# EAGLE schematic Programming_interface_PCB_Rev5 (EAGLE 9.6.2)

## Sheet 1 of 2
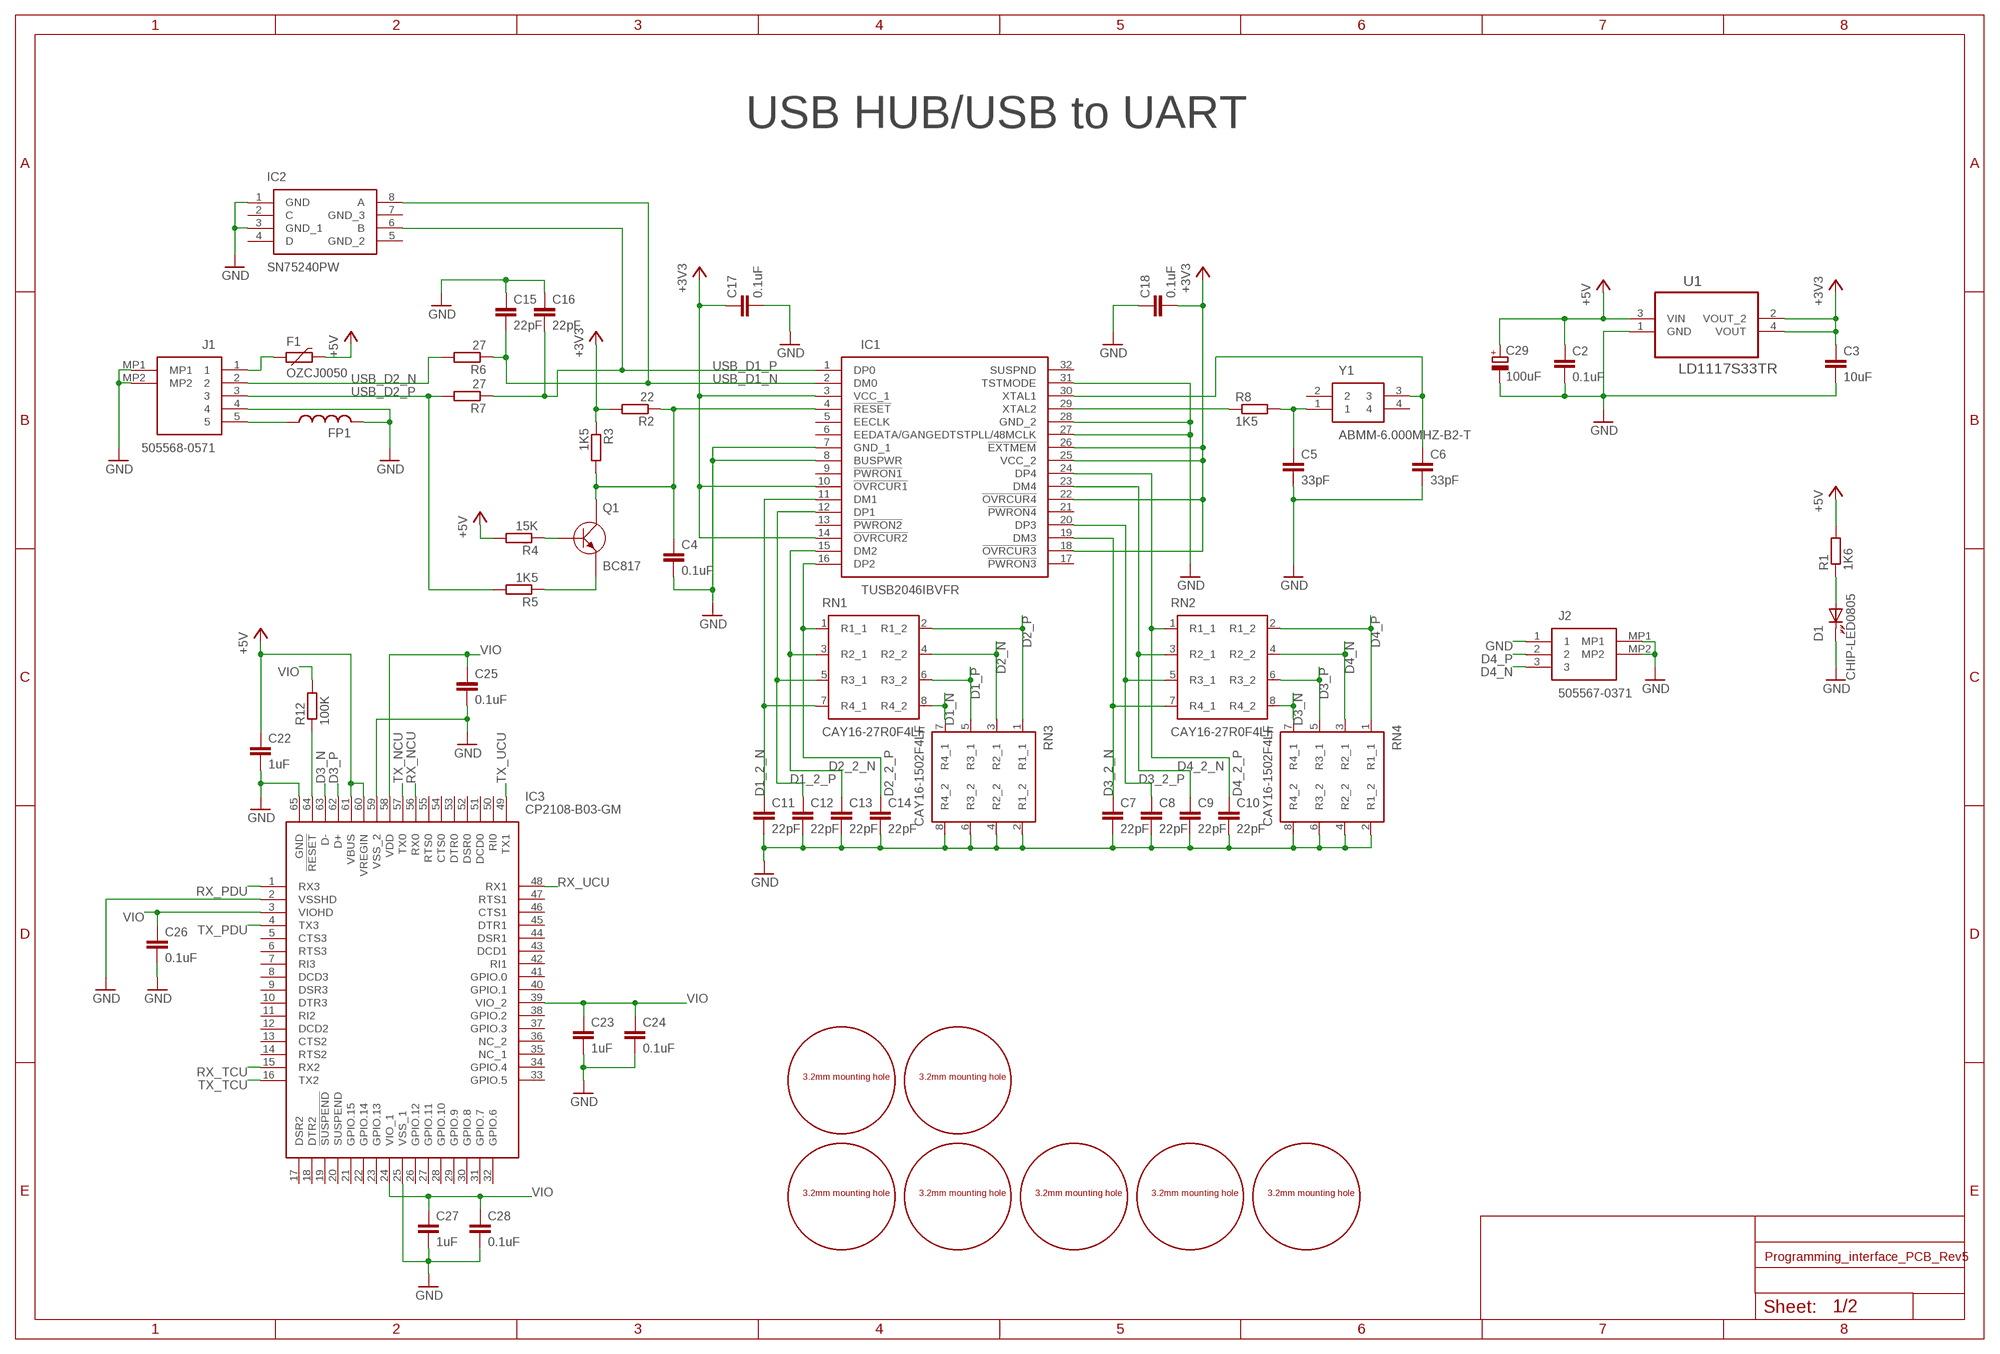
[diagram p0: schematic, sheet 1]

### Parts
C2  0.1uF  C0603  [C0603]
C3  10uF  C0603  [C0603]
C4  0.1uF  C0603  [C0603]
C5  33pF  C0603  [C0603]
C6  33pF  C0603  [C0603]
C7  22pF  C0603  [C0603]
C8  22pF  C0603  [C0603]
C9  22pF  C0603  [C0603]
C10  22pF  C0603  [C0603]
C11  22pF  C0603  [C0603]
C12  22pF  C0603  [C0603]
C13  22pF  C0603  [C0603]
C14  22pF  C0603  [C0603]
C15  22pF  C0603  [C0603]
C16  22pF  C0603  [C0603]
C17  0.1uF  C0603  [C0603]
C18  0.1uF  C0603  [C0603]
C22  1uF  C0603  [C0603]
C23  1uF  C0603  [C0603]
C24  0.1uF  C0603  [C0603]
C25  0.1uF  C0603  [C0603]
C26  0.1uF  C0603  [C0603]
C27  1uF  C0603  [C0603]
C28  0.1uF  C0603  [C0603]
C29  100uF  PANASONIC_C  [PANASONIC_C]
D1  CHIP-LED0805  [CHIP-LED0805]
F1  OZCJ0050  OZCJ  [OZCJ]
FP1  BLM18A  [R0603]
IC1  TUSB2046IBVFR  [QFP80P900X900X160-32N]
IC2  SN75240PW  [SOP65P640X120-8N]
IC3  CP2108-B03-GM  [QFN50P900X900X90-65N]
J1  505568-0571  [5055680571]
J2  505567-0371  [5055680371]
Q1  BC817  [SOT23]
R1  1K6  R0603  [R0603]
R2  22  R0805  [R0805]
R3  1K5  R0805  [R0805]
R4  15K  R0603  [R0603]
R5  1K5  R0603  [R0603]
R6  27  R0603  [R0603]
R7  27  R0603  [R0603]
R8  1K5  R0603  [R0603]
R12  100K  R0603  [R0603]
RN1  CAY16-27R0F4LF  [CAY16-J4]
RN2  CAY16-27R0F4LF  [CAY16-J4]
RN3  CAY16-1502F4LF  [CAY16-J4]
RN4  CAY16-1502F4LF  [CAY16-J4]
U1  LD1117S33TR  [SOT230P700X180-4N]
U$1  M3_MOUNTING_HOLE  [M3_MOUNTING_HOLE]
U$2  M3_MOUNTING_HOLE  [M3_MOUNTING_HOLE]
U$3  M3_MOUNTING_HOLE  [M3_MOUNTING_HOLE]
U$4  M3_MOUNTING_HOLE  [M3_MOUNTING_HOLE]
U$5  M3_MOUNTING_HOLE  [M3_MOUNTING_HOLE]
U$6  M3_MOUNTING_HOLE  [M3_MOUNTING_HOLE]
U$7  M3_MOUNTING_HOLE  [M3_MOUNTING_HOLE]
Y1  ABMM-6.000MHZ-B2-T  [ABMM-6.000MHZ-B2-T]

### Nets
+3V3: C3.1 C17.1 C18.2 IC1.3(VCC_1) IC1.10(!OVRCUR1) IC1.14(!OVRCUR2) IC1.18(!OVRCUR3) IC1.22(!OVRCUR4) IC1.25(VCC_2) IC1.26(!EXTMEM) R2.2 R3.1 U1.2(VOUT_2) U1.4(VOUT) ; also sheet 2
+5V: C2.1 C22.1 C29.+ F1.1 IC3.60(VREGIN) IC3.61(VBUS) R1.2 R4.2 U1.3(VIN) ; also sheet 2
D1_2_N: C11.1 IC1.11(DM1) RN1.7(R4_1)
D1_2_P: C12.1 IC1.12(DP1) RN1.5(R3_1)
D1_N: RN1.8(R4_2) RN3.7(R4_1) ; also sheet 2
D1_P: RN1.6(R3_2) RN3.5(R3_1) ; also sheet 2
D2_2_N: C13.1 IC1.15(DM2) RN1.3(R2_1)
D2_2_P: C14.1 IC1.16(DP2) RN1.1(R1_1)
D2_N: RN1.4(R2_2) RN3.3(R2_1) ; also sheet 2
D2_P: RN1.2(R1_2) RN3.1(R1_1) ; also sheet 2
D3_2_N: C7.1 IC1.19(DM3) RN2.7(R4_1)
D3_2_P: C8.1 IC1.20(DP3) RN2.5(R3_1)
D3_N: IC3.63(D-) RN2.8(R4_2) RN4.7(R4_1)
D3_P: IC3.62(D+) RN2.6(R3_2) RN4.5(R3_1)
D4_2_N: C9.1 IC1.23(DM4) RN2.3(R2_1)
D4_2_P: C10.1 IC1.24(DP4) RN2.1(R1_1)
D4_N: J2.3 RN2.4(R2_2) RN4.3(R2_1)
D4_P: J2.2 RN2.2(R1_2) RN4.1(R1_1)
GND: C2.2 C3.2 C4.2 C5.2 C6.2 C7.2 C8.2 C9.2 C10.2 C11.2 C12.2 C13.2 C14.2 C15.1 C16.1 C17.2 C18.1 C22.2 C23.2 C24.2 C25.2 C26.2 C27.2 C28.2 C29.- D1.C(K) FP1.2 IC1.7(GND_1) IC1.8(BUSPWR) IC1.27(TSTPLL/48MCLK) IC1.28(GND_2) IC1.31(TSTMODE) IC2.1(GND) IC2.3(GND_1) IC3.2(VSSHD) IC3.25(VSS_1) IC3.59(VSS_2) IC3.65(GND) J1.4 J1.MP1 J1.MP2 J2.1 J2.MP1 J2.MP2 RN3.2(R1_2) RN3.4(R2_2) RN3.6(R3_2) RN3.8(R4_2) RN4.2(R1_2) RN4.4(R2_2) RN4.6(R3_2) RN4.8(R4_2) U1.1(GND) ; also sheet 2
N$1: C4.1 IC1.4(!RESET) Q1.3(C) R2.1 R3.2
N$2: FP1.1 J1.5
N$3: Q1.1(B) R4.1
N$4: Q1.2(E) R5.1
N$7: D1.A R1.1
N$10: IC1.29(XTAL2) R8.1
N$11: C6.1 IC1.30(XTAL1) Y1.3
N$12: C5.1 R8.2 Y1.1
N$19: IC3.64(!RESET) R12.1
N$27: F1.2 J1.1
RX_NCU: IC3.56(RX0) ; also sheet 2
RX_PDU: IC3.1(RX3) ; also sheet 2
RX_TCU: IC3.15(RX2) ; also sheet 2
RX_UCU: IC3.48(RX1) ; also sheet 2
TX_NCU: IC3.57(TX0) ; also sheet 2
TX_PDU: IC3.4(TX3) ; also sheet 2
TX_TCU: IC3.16(TX2) ; also sheet 2
TX_UCU: IC3.49(TX1) ; also sheet 2
USB_D1_N: C15.2 IC1.2(DM0) IC2.8(A) R6.1
USB_D1_P: C16.2 IC1.1(DP0) IC2.6(B) R7.1
USB_D2_N: J1.2 R6.2
USB_D2_P: J1.3 R5.2 R7.2
VIO: C23.1 C24.1 C25.1 C26.1 C27.1 C28.1 IC3.3(VIOHD) IC3.24(VIO_1) IC3.39(VIO_2) IC3.58(VDD) R12.2
Unconnected: IC1.5(EECLK) IC1.6(EEDATA/GANGED) IC1.9(!PWRON1) IC1.13(!PWRON2) IC1.17(!PWRON3) IC1.21(!PWRON4) IC1.32(SUSPND) IC2.2(C) IC2.4(D) IC3.5(CTS3) IC3.6(RTS3) IC3.7(RI3) IC3.8(DCD3) IC3.9(DSR3) IC3.10(DTR3) IC3.11(RI2) IC3.12(DCD2) IC3.13(CTS2) IC3.14(RTS2) IC3.17(DSR2) IC3.18(DTR2) IC3.19(!SUSPEND) IC3.20(SUSPEND) IC3.21(GPIO.15) IC3.22(GPIO.14) IC3.23(GPIO.13) IC3.26(GPIO.12) IC3.27(GPIO.11) IC3.28(GPIO.10) IC3.29(GPIO.9) IC3.30(GPIO.8) IC3.31(GPIO.7) IC3.32(GPIO.6) IC3.33(GPIO.5) IC3.34(GPIO.4) IC3.35(NC_1) IC3.36(NC_2) IC3.37(GPIO.3) IC3.38(GPIO.2) IC3.40(GPIO.1) IC3.41(GPIO.0) IC3.42(RI1) IC3.43(DCD1) IC3.44(DSR1) IC3.45(DTR1) IC3.46(CTS1) IC3.47(RTS1) IC3.50(RI0) IC3.51(DCD0) IC3.52(DSR0) IC3.53(DTR0) IC3.54(CTS0) IC3.55(RTS0) Y1.2 Y1.4

### Notes on the sheet
- USB HUB/USB to UART

## Sheet 2 of 2
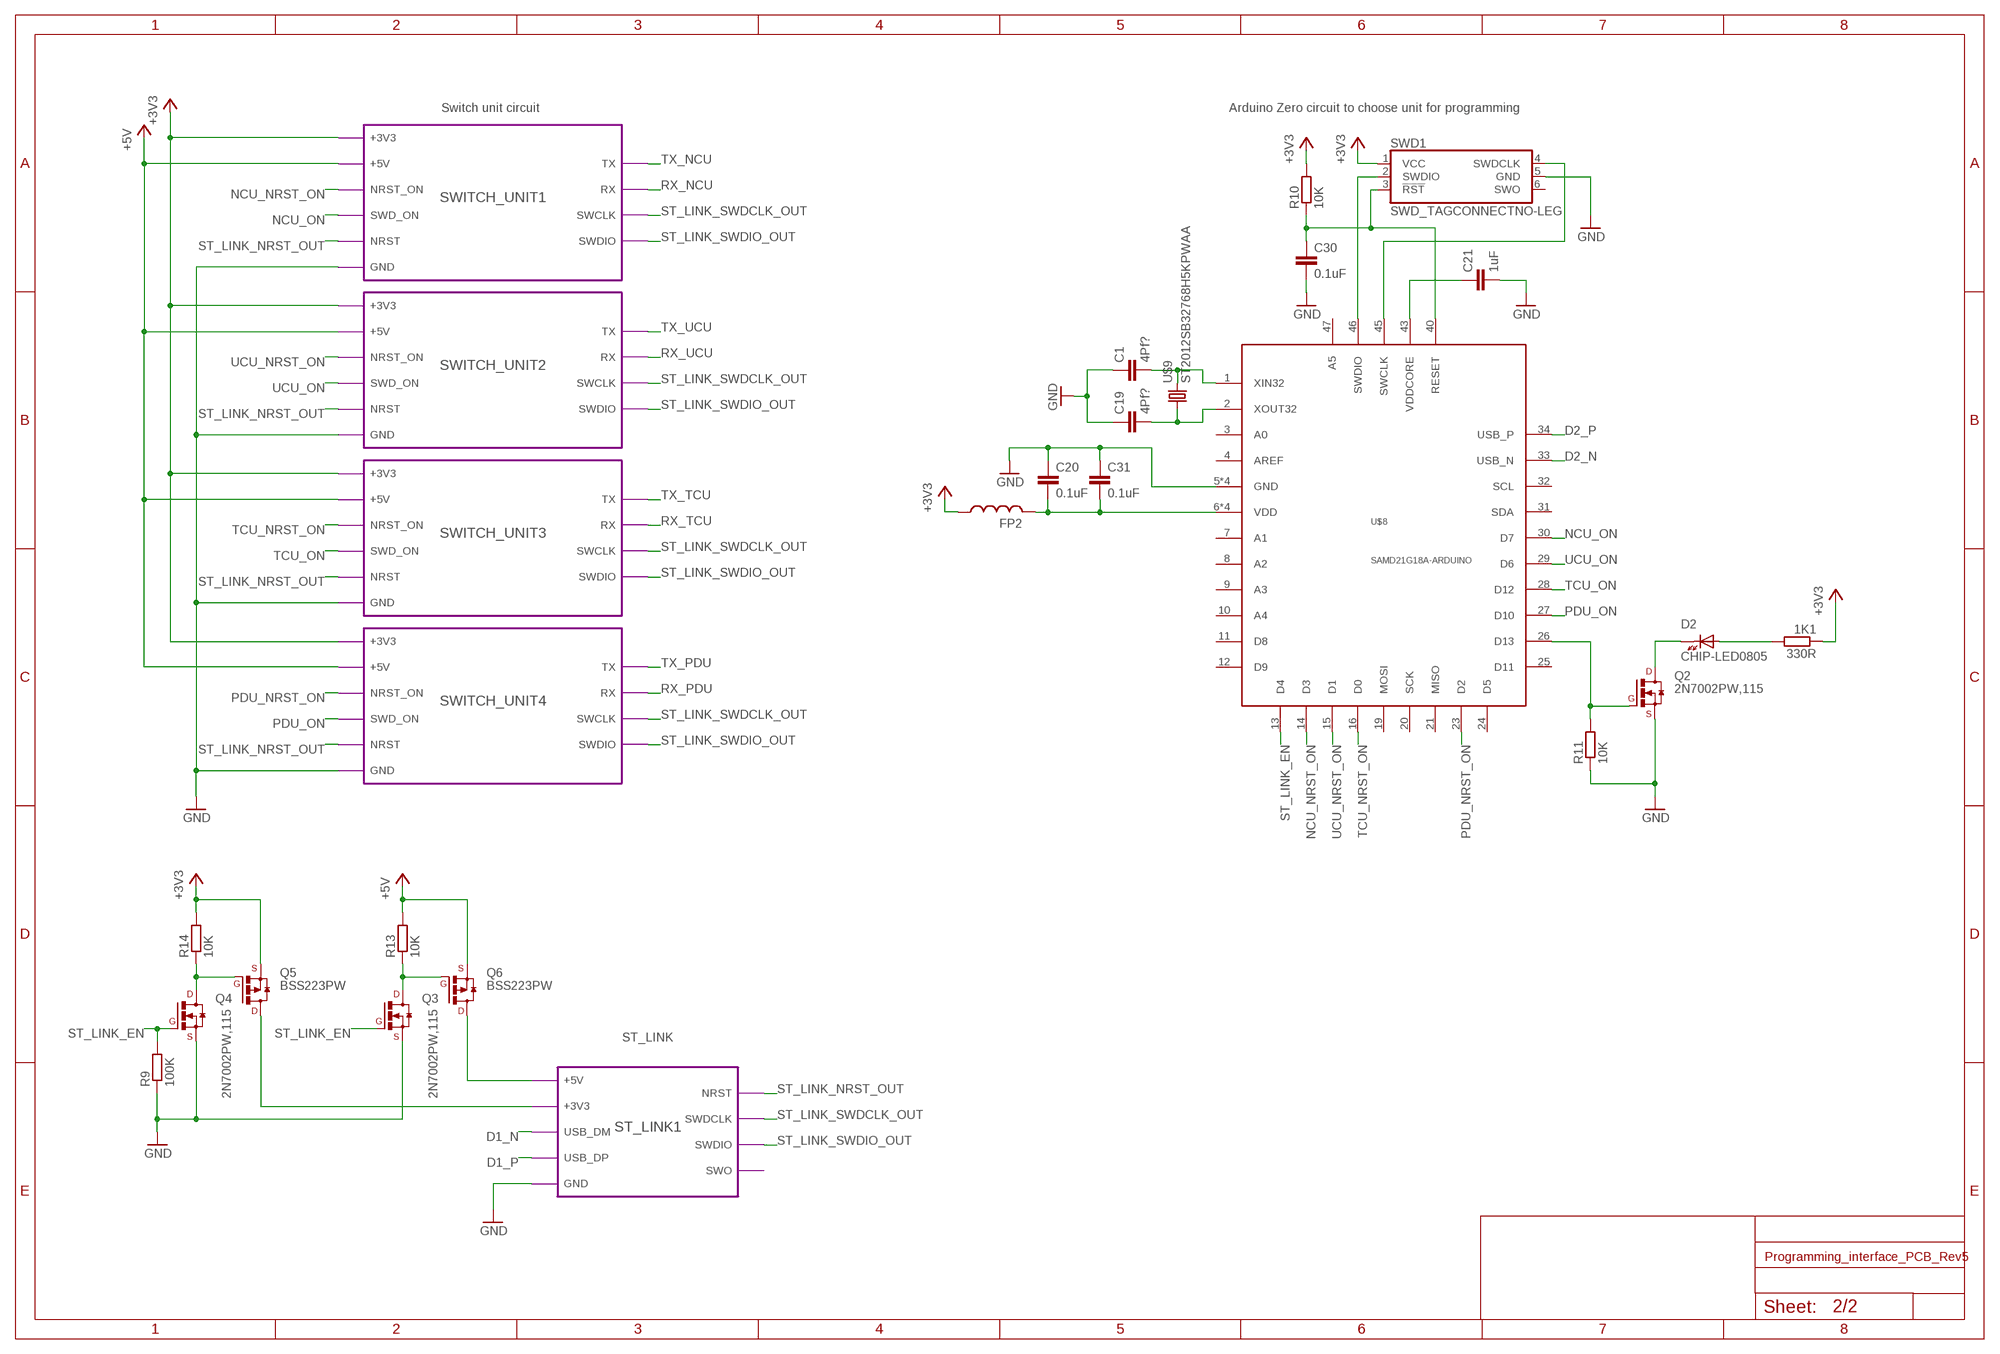
[diagram p1: schematic, sheet 2]

### Parts
330R  1K1  R0603  [R0603]
C1  4Pf?  C0603  [C0603]
C19  4Pf?  C0603  [C0603]
C20  0.1uF  C0603  [C0603]
C21  1uF  C0603  [C0603]
C30  0.1uF  C0603  [C0603]
C31  0.1uF  C0603  [C0603]
D2  CHIP-LED0805  [CHIP-LED0805]
FP2  BLM18A  [R0603]
Q2  2N7002PW,115  [SOT323]
Q3  2N7002PW,115  [SOT323]
Q4  2N7002PW,115  [SOT323]
Q5  BSS223PW  [SOT323]
Q6  BSS223PW  [SOT323]
R9  100K  R0603  [R0603]
R10  10K  R0603  [R0603]
R11  10K  R0603  [R0603]
R13  10K  R0603  [R0603]
R14  10K  R0603  [R0603]
SWD1  SWD_TAGCONNECTNO-LEG  [TC2030-IDC-NL]
U$8  SAMD21G18A-ARDUINO  [TQFP48]
U$9  ST2012SB32768H5KPWAA  [ST2012SB32768H5KPWAA]

### Module instances
ST_LINK1 = ST_LINKV2_1
SWITCH_UNIT1 = SWITCH_UNIT
SWITCH_UNIT2 = SWITCH_UNIT
SWITCH_UNIT3 = SWITCH_UNIT
SWITCH_UNIT4 = SWITCH_UNIT

### Nets
+3V3: 330R.1 FP2.1 Q5.2(S) R10.2 R14.2 SWD1.1(VCC) ; port SWITCH_UNIT1.+3V3 SWITCH_UNIT4.+3V3 SWITCH_UNIT3.+3V3 SWITCH_UNIT2.+3V3 ; also sheet 1
+5V: Q6.2(S) R13.2 ; port SWITCH_UNIT4.+5V SWITCH_UNIT3.+5V SWITCH_UNIT1.+5V SWITCH_UNIT2.+5V ; also sheet 1
D1_N: port ST_LINK1.USB_DM ; also sheet 1
D1_P: port ST_LINK1.USB_DP ; also sheet 1
D2_N: U$8.33(USB_N) ; also sheet 1
D2_P: U$8.34(USB_P) ; also sheet 1
GND: C1.1 C19.1 C20.1 C21.2 C30.2 C31.1 Q2.2(S) Q3.2(S) Q4.2(S) R9.1 R11.1 SWD1.5(GND) U$8.5(GND) U$8.18(GND) U$8.35(GND) U$8.42(GND) ; port ST_LINK1.GND SWITCH_UNIT1.GND SWITCH_UNIT2.GND SWITCH_UNIT3.GND SWITCH_UNIT4.GND ; also sheet 1
N$5: Q4.3(D) Q5.1(G) R14.1
N$6: Q3.3(D) Q6.1(G) R13.1
N$8: C20.2 C31.2 FP2.2 U$8.6(VDD) U$8.17(VDD) U$8.36(VDD) U$8.44(VDD)
N$9: C1.2 U$8.1(XIN32) U$9.P$2
N$13: C19.2 U$8.2(XOUT32) U$9.P$1
N$14: SWD1.2(SWDIO) U$8.46(SWDIO)
N$15: C30.1 R10.1 SWD1.3(!RST) U$8.40(RESET)
N$16: SWD1.4(SWDCLK) U$8.45(SWCLK)
N$17: C21.1 U$8.43(VDDCORE)
N$18: 330R.2 D2.A
N$20: D2.C(K) Q2.3(D)
N$21: Q6.3(D) ; port ST_LINK1.+5V
N$22: Q2.1(G) R11.2 U$8.26(D13)
N$23: Q5.3(D) ; port ST_LINK1.+3V3
NCU_NRST_ON: U$8.14(D3) ; port SWITCH_UNIT1.NRST_ON
NCU_ON: U$8.30(D7) ; port SWITCH_UNIT1.SWD_ON
PDU_NRST_ON: U$8.23(D2) ; port SWITCH_UNIT4.NRST_ON
PDU_ON: U$8.27(D10) ; port SWITCH_UNIT4.SWD_ON
RX_NCU: port SWITCH_UNIT1.RX ; also sheet 1
RX_PDU: port SWITCH_UNIT4.RX ; also sheet 1
RX_TCU: port SWITCH_UNIT3.RX ; also sheet 1
RX_UCU: port SWITCH_UNIT2.RX ; also sheet 1
ST_LINK_EN: Q3.1(G) Q4.1(G) R9.2 U$8.13(D4)
ST_LINK_NRST_OUT: port ST_LINK1.NRST SWITCH_UNIT1.NRST SWITCH_UNIT2.NRST SWITCH_UNIT3.NRST SWITCH_UNIT4.NRST
ST_LINK_SWDCLK_OUT: port ST_LINK1.SWDCLK SWITCH_UNIT1.SWCLK SWITCH_UNIT2.SWCLK SWITCH_UNIT3.SWCLK SWITCH_UNIT4.SWCLK
ST_LINK_SWDIO_OUT: port ST_LINK1.SWDIO SWITCH_UNIT4.SWDIO SWITCH_UNIT3.SWDIO SWITCH_UNIT2.SWDIO SWITCH_UNIT1.SWDIO
TCU_NRST_ON: U$8.16(D0) ; port SWITCH_UNIT3.NRST_ON
TCU_ON: U$8.28(D12) ; port SWITCH_UNIT3.SWD_ON
TX_NCU: port SWITCH_UNIT1.TX ; also sheet 1
TX_PDU: port SWITCH_UNIT4.TX ; also sheet 1
TX_TCU: port SWITCH_UNIT3.TX ; also sheet 1
TX_UCU: port SWITCH_UNIT2.TX ; also sheet 1
UCU_NRST_ON: U$8.15(D1) ; port SWITCH_UNIT2.NRST_ON
UCU_ON: U$8.29(D6) ; port SWITCH_UNIT2.SWD_ON
Unconnected: SWD1.6(SWO) U$8.3(A0) U$8.4(AREF) U$8.7(A1) U$8.8(A2) U$8.9(A3) U$8.10(A4) U$8.11(D8) U$8.12(D9) U$8.19(MOSI) U$8.20(SCK) U$8.21(MISO) U$8.24(D5) U$8.25(D11) U$8.31(SDA) U$8.32(SCL) U$8.47(A5)

### Notes on the sheet
- Switch unit circuit | Arduino Zero circuit to choose unit for programming
- ST_LINK

## Power pins joined to a net without a drawn wire
GND_2: IC2.5(GND_2)
GND_3: IC2.7(GND_3)

## Library data of the parts
330R R1 R4-R14 = CASE-RCL:R0603: Standard Chip RESISTOR 0603 (1608 Metric) Description: Standard Chip RESISTOR 0603 (1608 Metric)
C1-C28 C30 C31 = CASE-RCL:C0603: Standard Chip CAPACITOR 0605 (1608 Metric) Description: Standard Chip CAPACITOR 0605 (1608 Metric)
C29 = CASE-RCL:PANASONIC_C: Panasonic VS Type Aluminum Electrolytic SMD Capacitors Size C - (TEAPO D5) Description: Size C of VS type SMD capacitor from Panasonic. Diameter of cap = 5mm. (TEAPO D5) Links: TEAPO1 <http://www.farnell.com/datasheets/2622415.pdf?_ga=2.91453018.1951585514.1537363662-1535130828.1530438260> TEAPO2 <http://www.teapo.com.tw/WebSiteFile/Products/Product_Data/EV%20%20SPEC.pdf> PANASONIC <https://industrial.panasonic.com/cdbs/www-data/pdf/RDE0000/DME0000COL92.pdf>
D1 D2 = CASE-LED:CHIP-LED0805: CHIP-LED0805 (SMD) Description: Standard 0805 SMD CHIP-LED
F1 = CASE-Fuse:OZCJ: bel OZCJ Series PTC Fuses Description: OZCJ Series resettable PTC fuses from bel. Links: Datasheet <http://www.farnell.com/datasheets/2571638.pdf?_ga=2.17247801.1220548547.1537165482-1535130828.1530438260> 0ZCJ0005FF2E <https://se.farnell.com/bel-circuit-protection/0zcj0005ff2e/s-kring-terst-ll-ptc-60vdc-0-05a/dp/2834879?st=fuse> 0ZCJ0010FF2E <https://se.farnell.com/bel-circuit-protection/0zcj0010ff2e/s-kring-terst-llb-ptc-60vdc-0/dp/2834880?st=fuse> 0ZCJ0012FF2E <https://se.farnell.com/bel-circuit-protection/0zcj0012ff2e/s-kring-terst-ll-ptc-48vdc-0-12a/dp/2834881?st=fuse> 0ZCJ0016FF2E <https://se.farnell.com/bel-circuit-protection/0zcj0016ff2e/s-kring-terst-ll-ptc-48vdc-0-16a/dp/2834882?st=fuse> 0ZCJ0020FF2E <https://se.farnell.com/bel-circuit-protection/0zcj0020ff2e/s-kring-terst-llb-ptc-30vdc-0/dp/2834883?st=fuse> 0ZCJ0025AF2E <https://se.farnell.com/bel-circuit-protection/0zcj0025af2e/s-kring-terst-ll-ptc-24vdc-0-25a/dp/2834884?st=fuse> 0ZCJ0035AF2E <https://se.farnell.com/bel-circuit-protection/0zcj0035af2e/s-kring-terst-ll-ptc-30vdc-0-35a/dp/2834886> 0ZCJ0050AF2E <https://se.farnell.com/bel-circuit-protection/0zcj0050af2e/s-kring-terst-llb-ptc-24vdc-0/dp/2834888?st=fuse> 0ZCJ0075AF2E <https://se.farnell.com/bel-circuit-protection/0zcj0075af2e/s-kring-terst-ll-ptc-16vdc-0-75a/dp/2834890?st=fuse> 0ZCJ0100FF2E <https://se.farnell.com/bel-circuit-protection/0zcj0100ff2e/s-kring-terst-llb-ptc-6vdc-1a/dp/2834892?st=fuse> 0ZCJ0110FF2E <https://se.farnell.com/bel-circuit-protection/0zcj0110ff2e/s-kring-terst-llb-ptc-8vdc-1-1a/dp/2834893> 0ZCJ0150FF2C <https://se.farnell.com/bel-fuse/0zcj0150ff2c/fuse-resettable-ptc-8vdc-1-5a/dp/2848535> 0ZCJ0200FF2C <https://se.farnell.com/bel-circuit-protection/0zcj0200ff2c/s-kring-terst-llb-ptc-6vdc-2a/dp/2834895?st=fuse>
FP1 FP2 = CASE-RCL:BLM18A: muRata BLM18A Series Size 0603 Ferrite Pearls Description: BLM18A Series 0603 Size ferrite pearls from muRata. Links: Datasheet <http://www.farnell.com/datasheets/1756147.pdf?_ga=2.78732756.1951585514.1537363662-1535130828.1530438260> BLM18AG601SN1D <https://se.farnell.com/murata/blm18ag601sn1d/ferrite-bead-0603-0-38ohm-0-5a/dp/1515679?st=BLM18AG601SN1D>
IC1 = Programming_interface_lib:TUSB2046IBVFR: USB Interface IC 4-Port 12 Mbps USB Full-Speed Hub W/Optional Serial EEPROM Interface 32-LQFP -40 to 85 Source: Datasheet <http://www.ti.com/lit/ds/symlink/tusb2046i.pdf>; DESCRIPTION: USB Interface IC 4-Port 12 Mbps USB Full-Speed Hub W/Optional Serial EEPROM Interface 32-LQFP -40 to 85; HEIGHT: 1.6mm; MANUFACTURER_NAME: Texas Instruments; MANUFACTURER_PART_NUMBER: TUSB2046IBVFR; MOUSER_PART_NUMBER: 595-TUSB2046IBVFR; MOUSER_PRICE-STOCK: https://www.mouser.com/Search/Refine.aspx?Keyword=595-TUSB2046IBVFR
IC2 = Programming_interface_lib:SN75240PW: Dual USB Port Transient Suppressor Source: Datasheet <http://docs-emea.rs-online.com/webdocs/0c81/0900766b80c81ead.pdf>; DESCRIPTION: Dual USB Port Transient Suppressor; HEIGHT: 1.2mm; MANUFACTURER_NAME: Texas Instruments; MANUFACTURER_PART_NUMBER: SN75240PW; MOUSER_PART_NUMBER: 595-SN75240PW; MOUSER_PRICE-STOCK: https://www.mouser.com/Search/Refine.aspx?Keyword=595-SN75240PW; RS_PART_NUMBER: 6199853P; RS_PRICE-STOCK: http://uk.rs-online.com/web/p/products/6199853P
IC3 = Programming_interface_lib:CP2108-B03-GM: SILICON LABS - CP2108-B03-GM - USB TO UART BRIDGE, -40 TO 85DEG C Source: Datasheet <https://www.silabs.com/documents/public/data-sheets/cp2108-datasheet.pdf>; DESCRIPTION: SILICON LABS - CP2108-B03-GM - USB TO UART BRIDGE, -40 TO 85DEG C; HEIGHT: 0.9mm; MANUFACTURER_NAME: Silicon Labs; MANUFACTURER_PART_NUMBER: CP2108-B03-GM
J1 = Programming_interface_lib:505568-0571: Headers & Wire Housings MicroLockPlus 1.25MM VERT HDR SR 5CKT BLK Source: Datasheet <http://uk.rs-online.com/web/p/products/1615926P>; ALLIED_NUMBER: 71085525; DESCRIPTION: Headers & Wire Housings MicroLockPlus 1.25MM VERT HDR SR 5CKT BLK; HEIGHT: 4.05mm; MANUFACTURER_NAME: Molex; MANUFACTURER_PART_NUMBER: 505568-0571; RS_PART_NUMBER: 1615926P; RS_PRICE-STOCK: http://uk.rs-online.com/web/p/products/1615926P
J2 = RescueRunner:505567-0371: Horizontal
Q1 = CASE-Transistors:BC817: BC817 NPN Transistor (SOT-23) Description: Standard BC817 NPN Transistor in a SOT-23 package Links: BC817,215 <http://www.farnell.com/datasheets/699988.pdf?_ga=2.36626660.510093211.1546607516-411290609.1543318711>
Q2-Q4 = CASE-Transistors:2N7002PW,115: 2N7002PW,115 N-Channel Mosfet (SOT-323) Description: 2N7002PW,115 N-Channel Mosfet in a SOT-323 (SC-70) package Links: 2N7002PW,115 <http://www.farnell.com/datasheets/1760698.pdf?_ga=2.3009012.510093211.1546607516-411290609.1543318711>
Q5 Q6 = CASE-Transistors:BSS223PW: 2BSS 223PW P-Channel Mosfet (SOT-323) Description: BSS 223PW P-Channel Mosfet in a SOT-323 (SC-70) package Links: BSS 223PW <https://www.mouser.se/datasheet/2/196/Infineon-BSS223PW-DS-v01_05-en-469882.pdf>
R2 R3 = CASE-RCL:R0805: Standard Chip RESISTOR 0805 (2012 Metric) Description: Standard Chip RESISTOR 0805 (2012 Metric)
RN1 RN2 = RescueRunner:CAY16-27R0F4LF: BOURNS - CAY16-270J4LF - RESISTOR, ARRAY, 27R, 5%, 0.125W Source: Datasheet <http://uk.rs-online.com/web/p/products/7408782>; ALLIED_NUMBER: 70276336; DESCRIPTION: BOURNS - CAY16-270J4LF - RESISTOR, ARRAY, 27R, 5%, 0.125W; HEIGHT: mm; MANUFACTURER_NAME: Bourns; MANUFACTURER_PART_NUMBER: CAY16-270J4LF; RS_PART_NUMBER: 7408782; RS_PRICE-STOCK: http://uk.rs-online.com/web/p/products/7408782
RN3 RN4 = RescueRunner:CAY16-1502F4LF: BOURNS - CAY16-270J4LF - RESISTOR, ARRAY, 27R, 5%, 0.125W Source: Datasheet <http://uk.rs-online.com/web/p/products/7408782>; ALLIED_NUMBER: 70276336; DESCRIPTION: BOURNS - CAY16-270J4LF - RESISTOR, ARRAY, 27R, 5%, 0.125W; HEIGHT: mm; MANUFACTURER_NAME: Bourns; MANUFACTURER_PART_NUMBER: CAY16-270J4LF; RS_PART_NUMBER: 7408782; RS_PRICE-STOCK: http://uk.rs-online.com/web/p/products/7408782
SWD1 = CASE-Prog_Header:SWD_TAGCONNECT: SWD Programming header (Tag-Connect version) Description: SWD Programming header for Tag Connect TC2030-IDC, both legged and no-legged version Links: Tag-Connect <http://www.tag-connect.com/JLINK>
U1 = CASE-Voltage_regulators:LD1117S33TR: LD1117S33TR, 3.3V LDO voltage regulator, SOT-223-4 Description: LD1117S33TR, 3.3V LDO voltage regulator in SOT-223-3 package - Input voltage: 4.75-15V - Output voltage: 3.3V - Output current: 800mA - Dropout voltage: 1.1V Links: Datasheet <http://www.farnell.com/datasheets/1776449.pdf?_ga=2.71508627.1869469127.1547838600-114062766.1547494298>; MPN: LD1117S33TR; OC_FARNELL: 2253484; OC_NEWARK: 89K0627; PACKAGE: SOT223-3; SUPPLIER: STMicroelectronics
U$1-U$7 = Programming_interface_lib:M3_MOUNTING_HOLE
U$8 = Programming_interface_lib:SAMD21G18A-ARDUINO
U$9 = Programming_interface_lib:ST2012SB32768H5KPWAA: ST2012SB32768H5KPWAA https://www.mouser.se/ProductDetail/581-ST2012SB32H5KPWA
Y1 = Programming_interface_lib:ABMM-6.000MHZ-B2-T: Crystals 6.000MHz, 18pF 20ppm Source: Datasheet <http://uk.rs-online.com/web/p/products/1712721P>; DESCRIPTION: Crystals 6.000MHz, 18pF 20ppm; HEIGHT: mm; MANUFACTURER_NAME: ABRACON; MANUFACTURER_PART_NUMBER: ABMM-6.000MHZ-B2-T; RS_PART_NUMBER: 1712721P; RS_PRICE-STOCK: http://uk.rs-online.com/web/p/products/1712721P

## Module ST_LINKV2_1
Ports: +3V3(pwr) GND(pwr) +5V(pwr) USB_DM(io) USB_DP(io) SWO(io) SWDCLK(io) NRST(io) SWDIO(io)
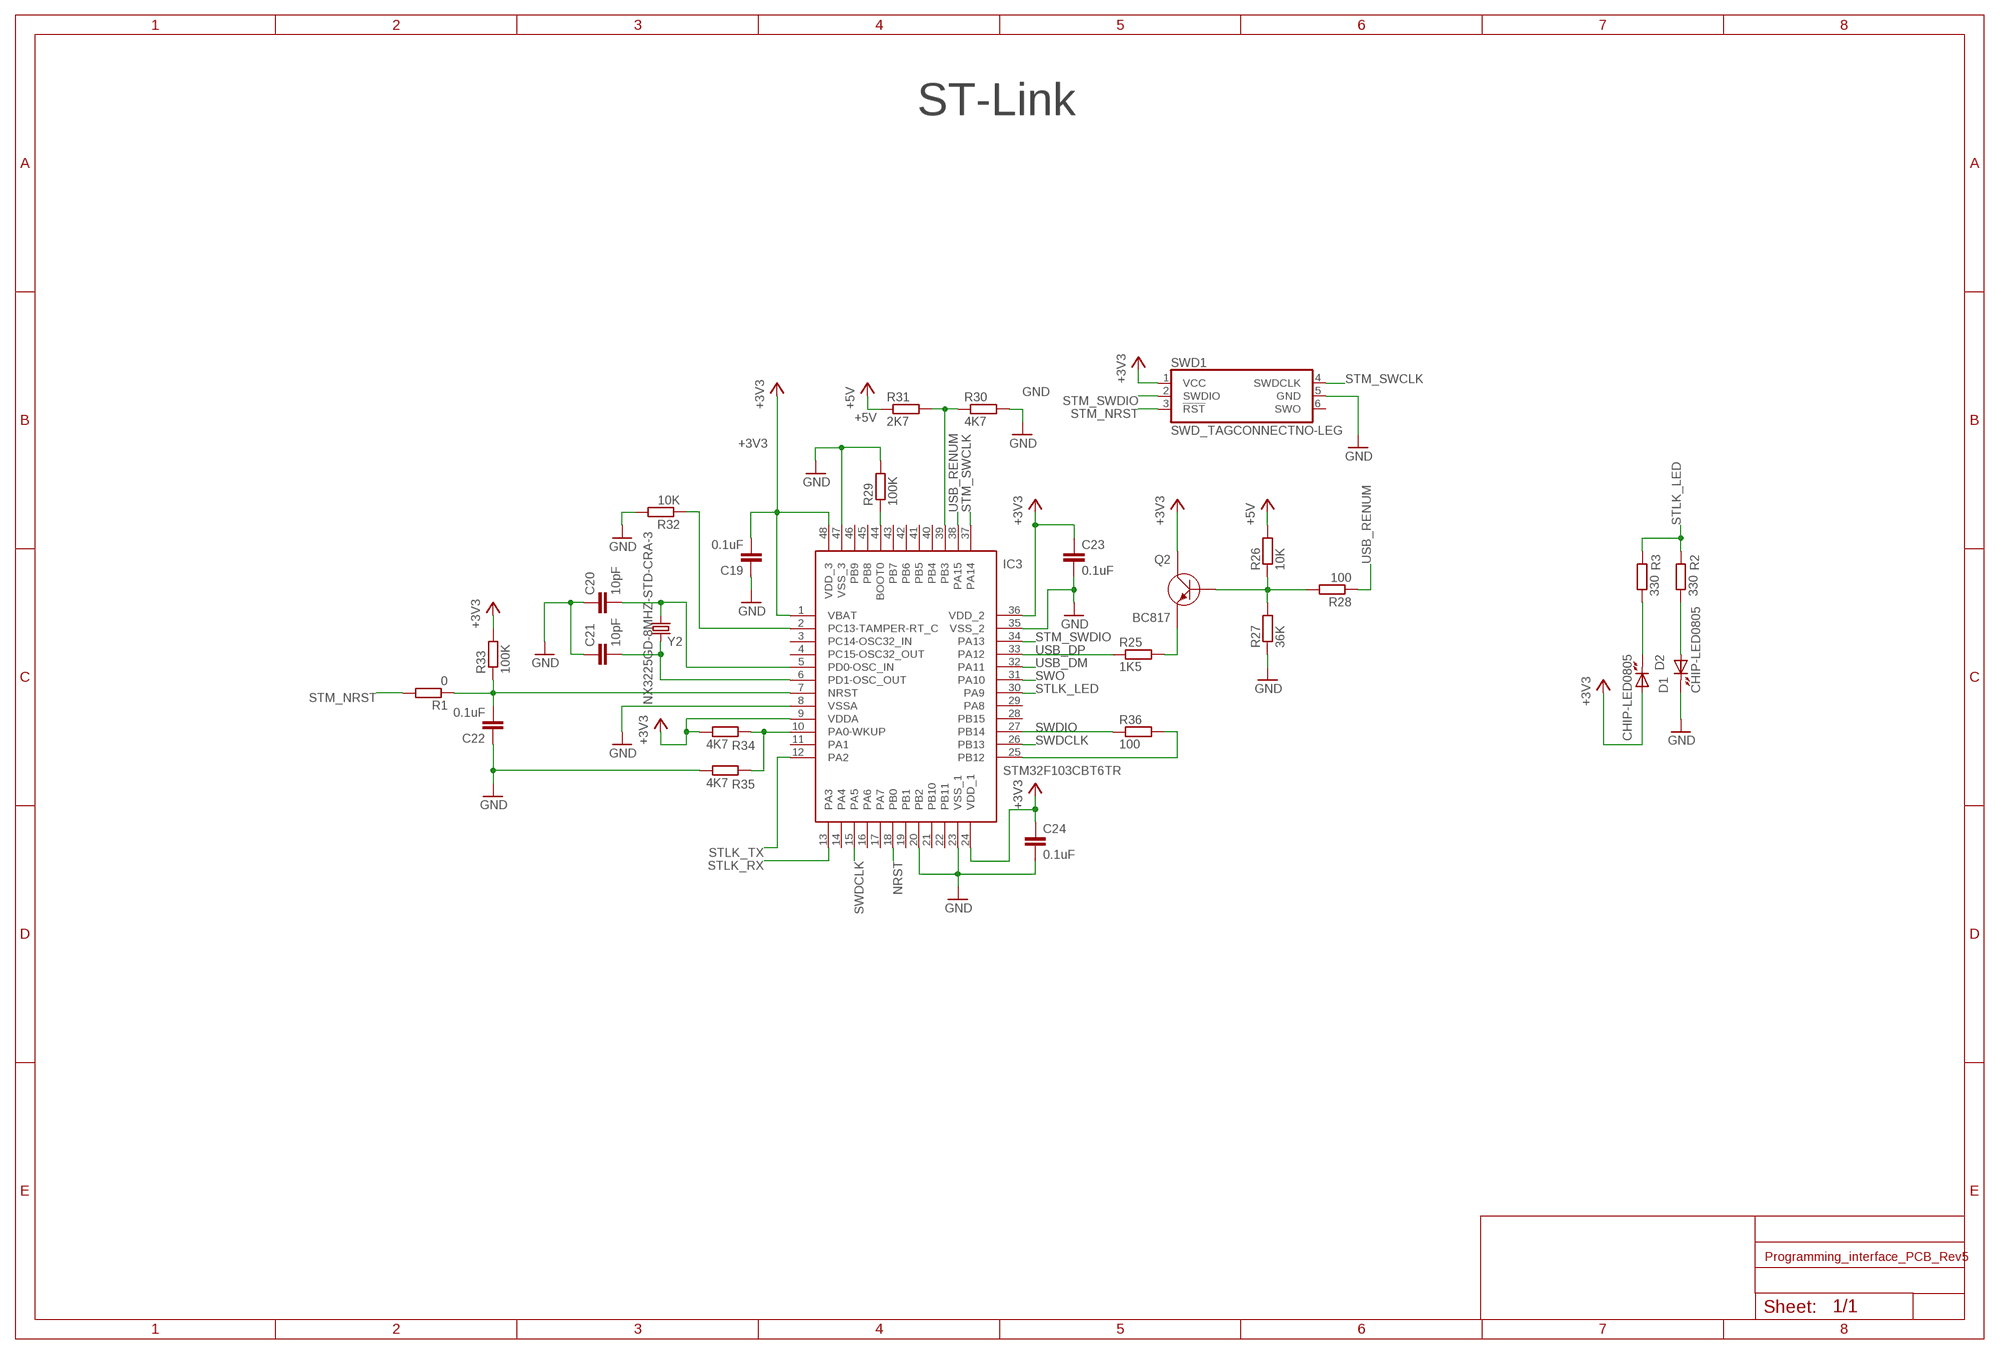
[diagram p2: schematic, module ST_LINKV2_1, sheet 1]

### Parts
C19  0.1uF  C0603  [C0603]
C20  10pF  C0603  [C0603]
C21  10pF  C0603  [C0603]
C22  0.1uF  C0603  [C0603]
C23  0.1uF  C0603  [C0603]
C24  0.1uF  C0603  [C0603]
D1  CHIP-LED0805  [CHIP-LED0805]
D2  CHIP-LED0805  [CHIP-LED0805]
IC3  STM32F103CBT6TR  [QFP50P900X900X160-48N]
Q2  BC817  [SOT23]
R1  0  R0603  [R0603]
R2  330  R0603  [R0603]
R3  330  R0603  [R0603]
R25  1K5  R0603  [R0603]
R26  10K  R0603  [R0603]
R27  36K  R0603  [R0603]
R28  100  R0603  [R0603]
R29  100K  R0603  [R0603]
R30  4K7  R0603  [R0603]
R31  2K7  R0603  [R0603]
R32  10K  R0603  [R0603]
R33  100K  R0603  [R0603]
R34  4K7  R0603  [R0603]
R35  4K7  R0603  [R0603]
R36  100  R0805  [R0805]
SWD1  SWD_TAGCONNECTNO-LEG  [TC2030-IDC-NL]
Y2  NX3225GD-8MHZ-STD-CRA-3  [RESC3226X100N]

### Nets
+3V3: C19.2 C23.1 C24.1 D2.A IC3.1(VBAT) IC3.9(VDDA) IC3.24(VDD_1) IC3.36(VDD_2) IC3.48(VDD_3) Q2.3(C) R33.2 R34.1 SWD1.1(VCC)
+5V: R26.2 R31.1
GND: C19.1 C20.1 C21.1 C22.1 C23.2 C24.2 D1.C(K) IC3.8(VSSA) IC3.20(PB2) IC3.23(VSS_1) IC3.35(VSS_2) IC3.47(VSS_3) R27.1 R29.2 R30.2 R32.2 R35.1 SWD1.5(GND)
N$1: D1.A R2.1
N$3: D2.C(K) R3.1
N$7: Q2.2(E) R25.2
N$8: Q2.1(B) R26.1 R27.2 R28.2
N$15: IC3.39(PB3) R30.1 R31.2
N$16: IC3.2(PC13-TAMPER-RT_C) R32.1
N$21: IC3.44(BOOT0) R29.1
N$22: C20.2 IC3.5(PD0-OSC_IN) Y2.1
N$23: IC3.10(PA0-WKUP) R34.2 R35.2
N$24: C21.2 IC3.6(PD1-OSC_OUT) Y2.2
N$25: C22.2 IC3.7(NRST) R1.1 R33.1
N$26: IC3.25(PB12) R36.2
NRST: IC3.18(PB0)
STLK_LED: IC3.30(PA9) R2.2 R3.2
STLK_RX: IC3.13(PA3)
STLK_TX: IC3.12(PA2)
STM_NRST: R1.2 SWD1.3(!RST)
STM_SWCLK: IC3.37(PA14) SWD1.4(SWDCLK)
STM_SWDIO: IC3.34(PA13) SWD1.2(SWDIO)
SWDCLK: IC3.15(PA5) IC3.26(PB13)
SWDIO: IC3.27(PB14) R36.1
SWO: IC3.31(PA10)
USB_DM: IC3.32(PA11)
USB_DP: IC3.33(PA12) R25.1
USB_RENUM: IC3.38(PA15) R28.1
Unconnected: IC3.3(PC14-OSC32_IN) IC3.4(PC15-OSC32_OUT) IC3.11(PA1) IC3.14(PA4) IC3.16(PA6) IC3.17(PA7) IC3.19(PB1) IC3.21(PB10) IC3.22(PB11) IC3.28(PB15) IC3.29(PA8) IC3.40(PB4) IC3.41(PB5) IC3.42(PB6) IC3.43(PB7) IC3.45(PB8) IC3.46(PB9) SWD1.6(SWO)

### Notes on the sheet
- ST-Link

### Library data of the parts
C19-C24 = CASE-RCL:C0603: Standard Chip CAPACITOR 0605 (1608 Metric) Description: Standard Chip CAPACITOR 0605 (1608 Metric)
D1 D2 = CASE-LED:CHIP-LED0805: CHIP-LED0805 (SMD) Description: Standard 0805 SMD CHIP-LED
IC3 = Programming_interface_lib:STM32F103CBT6TR: STMICROELECTRONICS - STM32F103CBT6TR - ARM MCU, STM32 Family STM32F1 Series Microcontrollers, ARM Cortex-M3, 32bit, 72 MHz, 128 KB, 20 KB Source: Datasheet <https://www.st.com/resource/en/datasheet/stm32f103cb.pdf>; DESCRIPTION: STMICROELECTRONICS - STM32F103CBT6TR - ARM MCU, STM32 Family STM32F1 Series Microcontrollers, ARM Cortex-M3, 32bit, 72 MHz, 128 KB, 20 KB; HEIGHT: 1.6mm; MANUFACTURER_NAME: STMicroelectronics; MANUFACTURER_PART_NUMBER: STM32F103CBT6TR
Q2 = CASE-Transistors:BC817: BC817 NPN Transistor (SOT-23) Description: Standard BC817 NPN Transistor in a SOT-23 package Links: BC817,215 <http://www.farnell.com/datasheets/699988.pdf?_ga=2.36626660.510093211.1546607516-411290609.1543318711>
R1-R3 R25-R35 = CASE-RCL:R0603: Standard Chip RESISTOR 0603 (1608 Metric) Description: Standard Chip RESISTOR 0603 (1608 Metric)
R36 = CASE-RCL:R0805: Standard Chip RESISTOR 0805 (2012 Metric) Description: Standard Chip RESISTOR 0805 (2012 Metric)
SWD1 = CASE-Prog_Header:SWD_TAGCONNECT: SWD Programming header (Tag-Connect version) Description: SWD Programming header for Tag Connect TC2030-IDC, both legged and no-legged version Links: Tag-Connect <http://www.tag-connect.com/JLINK>
Y2 = Programming_interface_lib:NX3225GD-8MHZ-STD-CRA-3: A small surface-mount type crystal unit, ideal for an engine control CPU clock; delivering the high reliability that is particularly demanded by automotive Source: Datasheet <http://uk.rs-online.com/web/p/products/1847983>; DESCRIPTION: A small surface-mount type crystal unit, ideal for an engine control CPU clock; delivering the high reliability that is particularly demanded by automotive; HEIGHT: 1mm; MANUFACTURER_NAME: NDK; MANUFACTURER_PART_NUMBER: NX3225GD-8MHZ-STD-CRA-3; RS_PART_NUMBER: 1847983; RS_PRICE-STOCK: http://uk.rs-online.com/web/p/products/1847983

## Module SWITCH_UNIT
Ports: +5V(pwr) GND(pwr) NRST_ON(io) SWD_ON(io) SWCLK(io) SWDIO(io) TX(io) RX(io) NRST(io) +3V3(pwr)
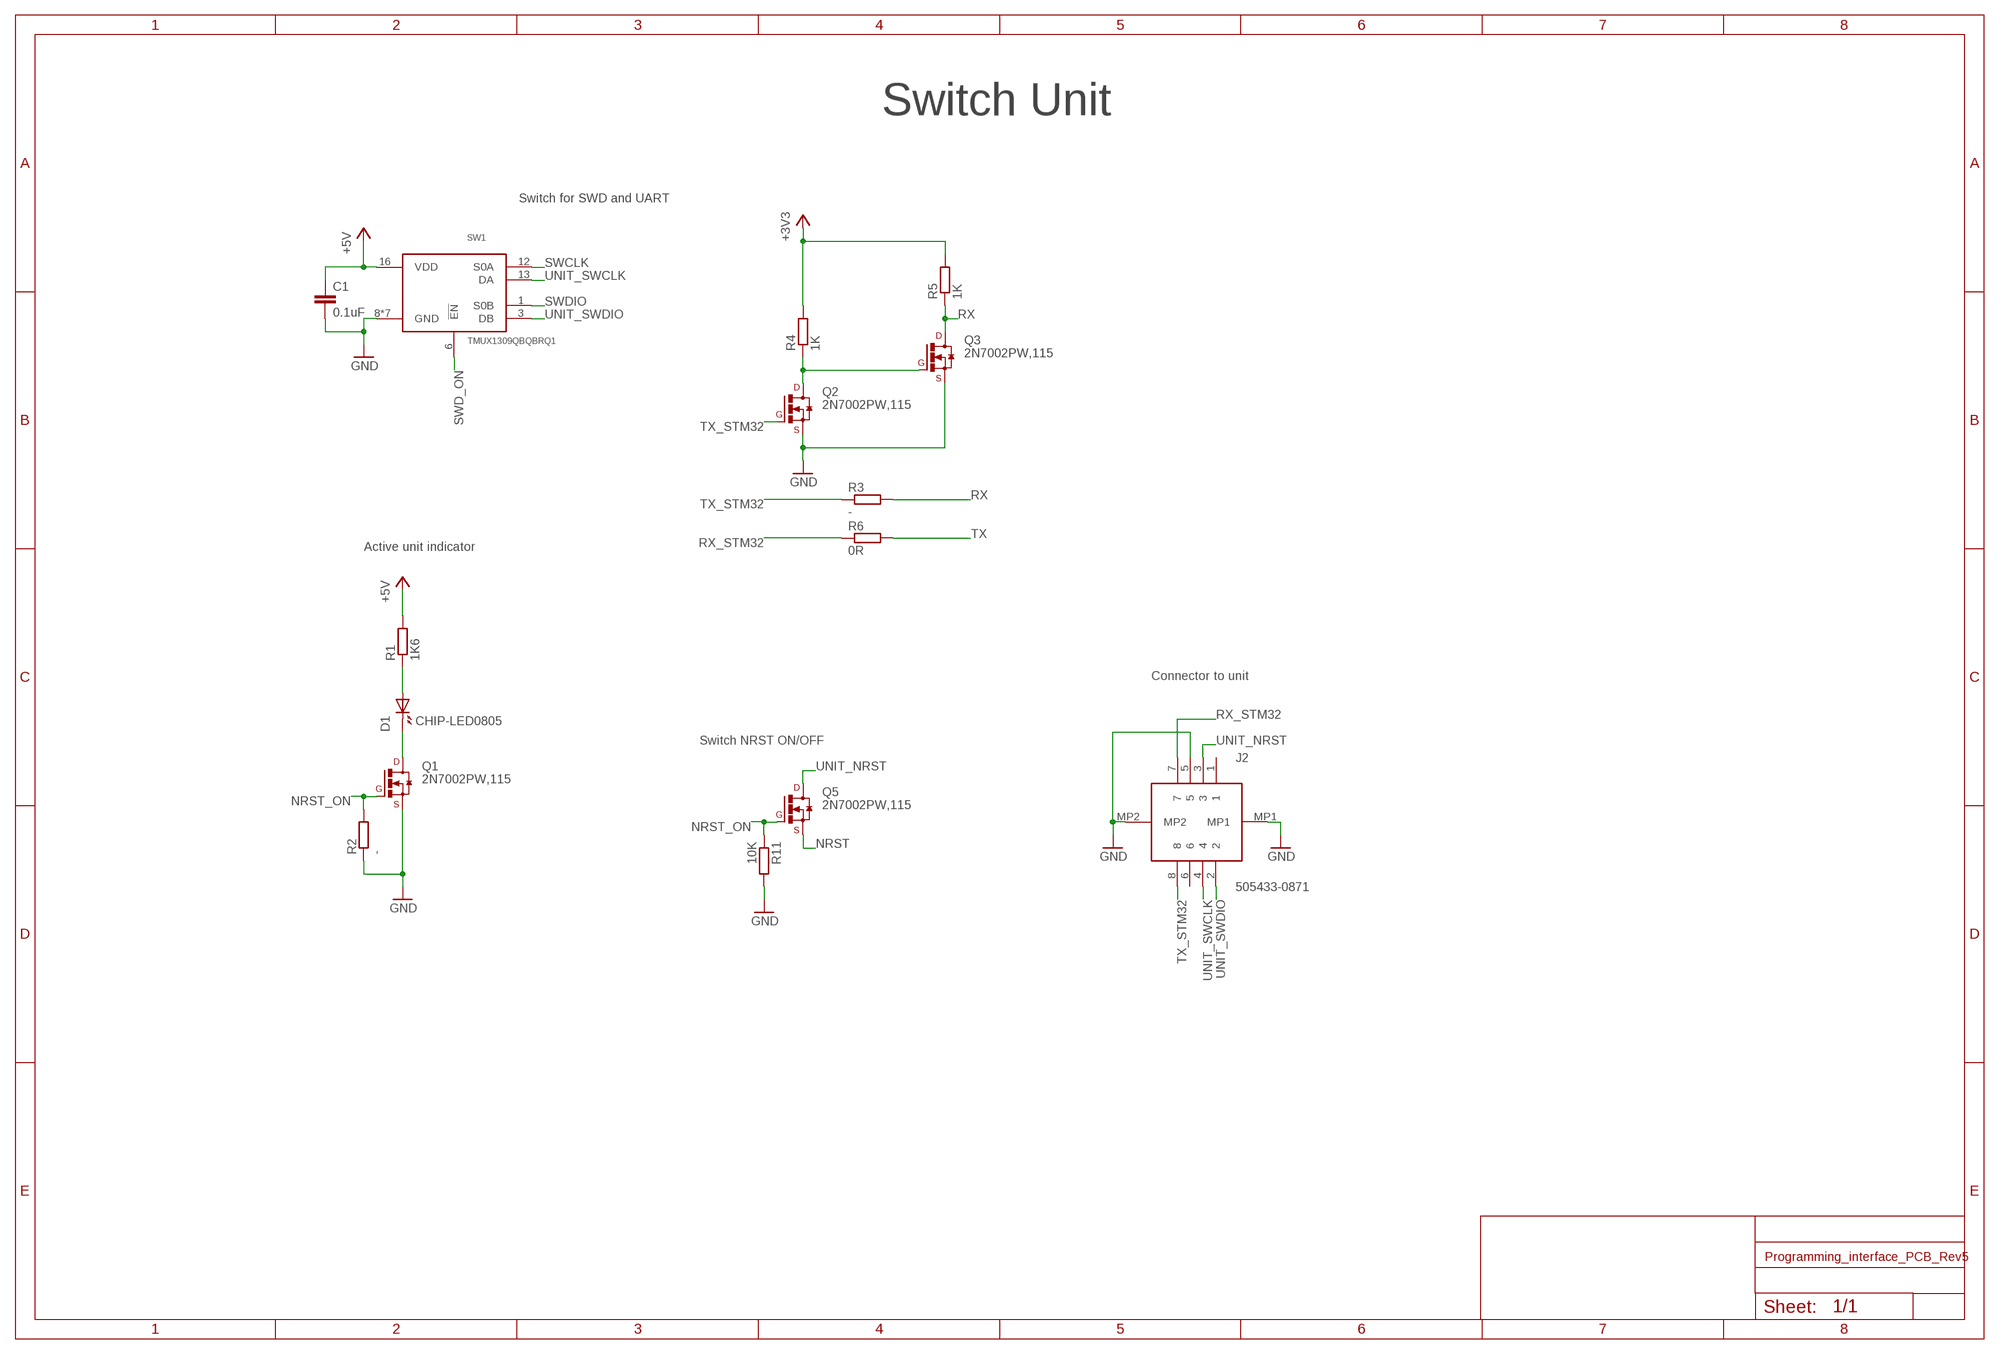
[diagram p3: schematic, module SWITCH_UNIT, sheet 1]

### Parts
C1  0.1uF  C0603  [C0603]
D1  CHIP-LED0805  [CHIP-LED0805]
J2  505433-0871  [5054330871]
Q1  2N7002PW,115  [SOT323]
Q2  2N7002PW,115  [SOT323]
Q3  2N7002PW,115  [SOT323]
Q5  2N7002PW,115  [SOT323]
R1  1K6  R0603  [R0603]
R2  -  R0603  [R0603]
R3  -  R0402  [R0402]
R4  1K  R0402  [R0402]
R5  1K  R0402  [R0402]
R6  0R  R0402  [R0402]
R11  10K  R0603  [R0603]
SW1  TMUX1309QBQBRQ1  [QFN16-4X4]

### Nets
+3V3: R4.2 R5.2
+5V: C1.1 R1.2 SW1.16(VDD)
GND: C1.2 J2.5 J2.MP1 J2.MP2 Q1.2(S) Q2.2(S) Q3.2(S) R2.1 R11.2 SW1.8(GND) SW1.9(GND) SW1.10(GND) SW1.EXP(GND) SW1.P$1(GND) SW1.P$2(GND) SW1.P$3(GND)
N$2: D1.C(K) Q1.3(D)
N$3: D1.A R1.1
N$4: Q2.3(D) Q3.1(G) R4.1
NRST: Q5.2(S)
NRST_ON: Q1.1(G) Q5.1(G) R2.2 R11.1
RX: Q3.3(D) R3.2 R5.1
RX_STM32: J2.7 R6.1
SWCLK: SW1.12(S0A)
SWD_ON: SW1.6(!EN)
SWDIO: SW1.1(S0B)
TX: R6.2
TX_STM32: J2.8 Q2.1(G) R3.1
UNIT_NRST: J2.3 Q5.3(D)
UNIT_SWCLK: J2.4 SW1.13(DA)
UNIT_SWDIO: J2.2 SW1.3(DB)
Unconnected: J2.1 J2.6

### Notes on the sheet
- Switch Unit
- Switch for SWD and UART
- Active unit indicator
- Connector to unit
- Switch NRST ON/OFF

### Library data of the parts
C1 = CASE-RCL:C0603: Standard Chip CAPACITOR 0605 (1608 Metric) Description: Standard Chip CAPACITOR 0605 (1608 Metric)
D1 = CASE-LED:CHIP-LED0805: CHIP-LED0805 (SMD) Description: Standard 0805 SMD CHIP-LED
J2 = Programming_interface_lib:505433-0871: CONN HEADER SMD 8POS 1.25MM Source: Datasheet <https://www.molex.com/pdm_docs/sd/5054330871_sd.pdf>; DESCRIPTION: CONN HEADER SMD 8POS 1.25MM; HEIGHT: 7.25mm; MANUFACTURER_NAME: Molex; MANUFACTURER_PART_NUMBER: 5054330871
Q1-Q3 Q5 = CASE-Transistors:2N7002PW,115: 2N7002PW,115 N-Channel Mosfet (SOT-323) Description: 2N7002PW,115 N-Channel Mosfet in a SOT-323 (SC-70) package Links: 2N7002PW,115 <http://www.farnell.com/datasheets/1760698.pdf?_ga=2.3009012.510093211.1546607516-411290609.1543318711>
R1 R2 R11 = CASE-RCL:R0603: Standard Chip RESISTOR 0603 (1608 Metric) Description: Standard Chip RESISTOR 0603 (1608 Metric)
R3-R6 = CASE-RCL:R0402: Standard Chip RESISTOR 0402 (1005 Metric) Description: Standard Chip RESISTOR 0402 (1005 Metric)
SW1 = Programming_interface_lib:TMUX1309QBQBRQ1

## Net classes
0 default: width 0.2 mm